# EAGLE design tutorial (EAGLE 8.7.0)
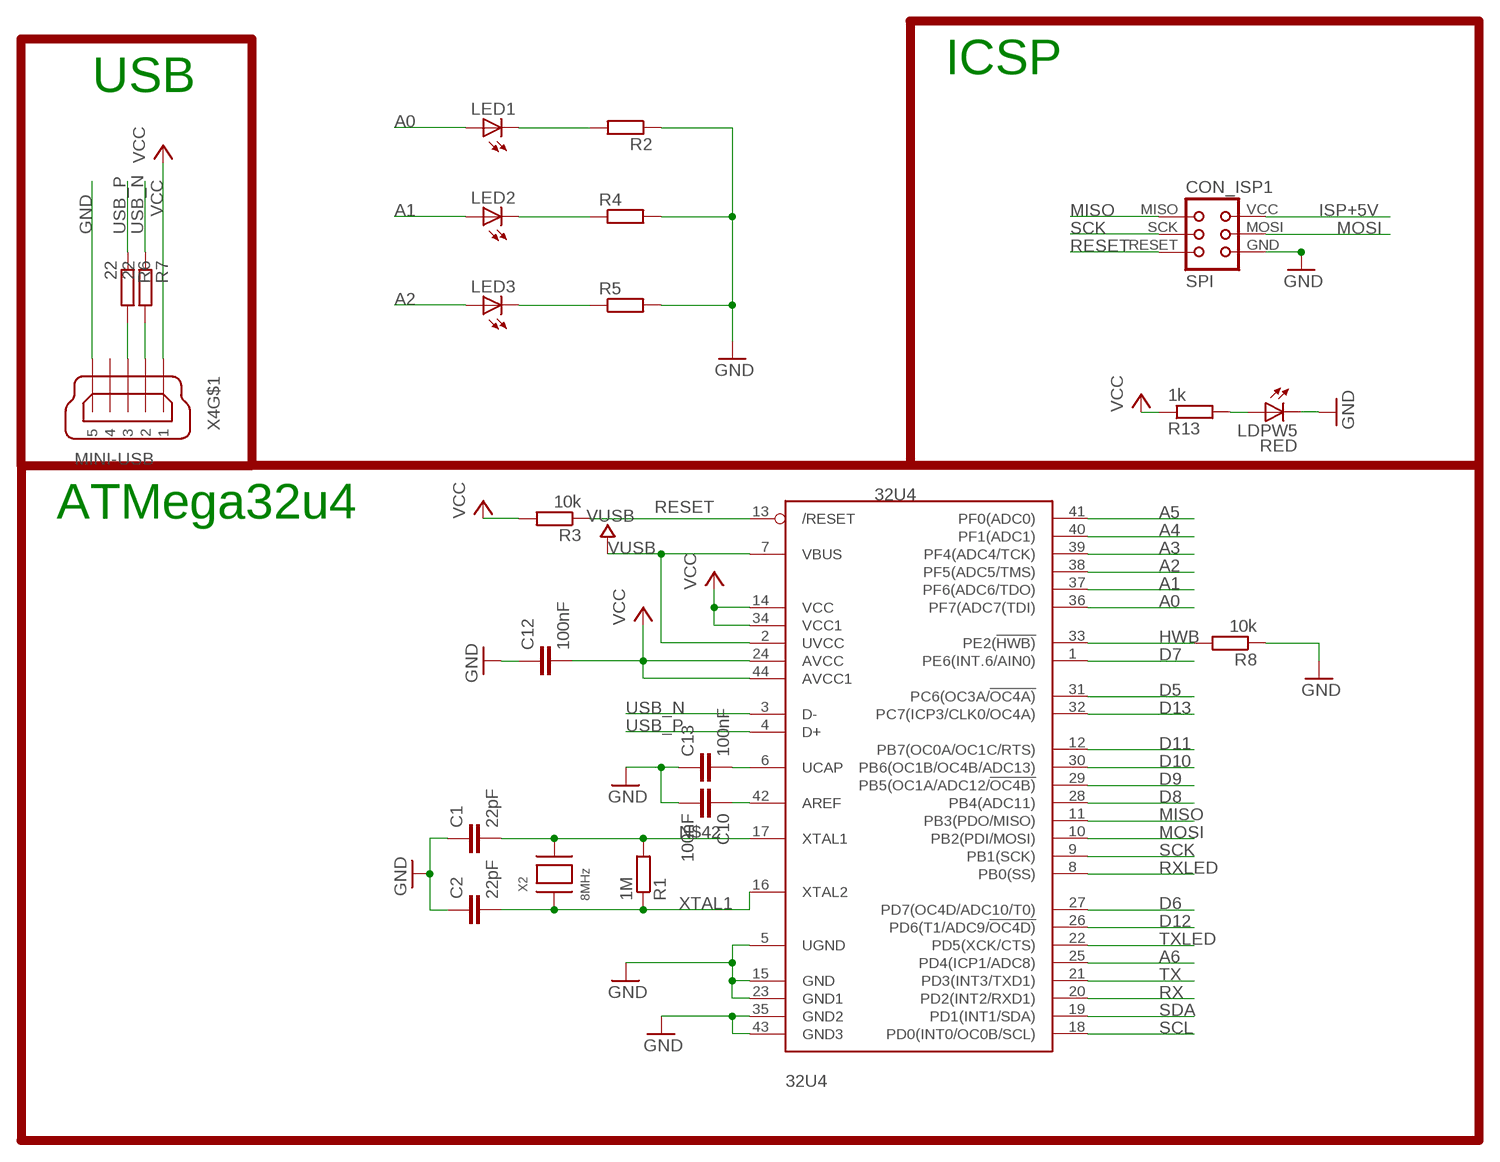
[diagram p0: schematic, sheet 1]

## Parts
32U4  32U4  ATMEGA32U4-AU  [TQFP44]
C1  22pF  C-EUC1206  [C1206]
C2  22pF  C-EUC1206  [C1206]
C10  100nF  C-EUC1206  [C1206]
C12  100nF  C-EUC1206  [C1206]
C13  100nF  C-EUC1206  [C1206]
CON_ISP1  SPI  TINYISP  [TINYISP]
LDPW5  RED  LED1206  [LED-1206]
LED1  LED5MM  [LED5MM]
LED2  LED5MM  [LED5MM]
LED3  LED5MM  [LED5MM]
R1  1M  R-EU_M1206  [M1206]
R2  R-EU_R1206  [R1206]
R3  10k  R-EU_M1206  [M1206]
R4  R-EU_R1206  [R1206]
R5  R-EU_R1206  [R1206]
R6  22  R-EU_M1206  [M1206]
R7  22  R-EU_M1206  [M1206]
R8  10k  R-EU_M1206  [M1206]
R13  1k  R-EU_M1206  [M1206]
X2  8MHz  XTALNX6035  [NX6035]
X4  MINI-USB  MINI-USB-SCHIELD-32005-201  [32005-201]

## Nets
A0: 32U4.36(PF7(ADC7(TDI)) LED1.A
A1: 32U4.37(PF6(ADC6/TDO)) LED2.A
A2: 32U4.38(PF5(ADC5/TMS)) LED3.A
A3: 32U4.39(PF4(ADC4/TCK))
A4: 32U4.40(PF1(ADC1))
A5: 32U4.41(PF0(ADC0))
A6: 32U4.25(PD4(ICP1/ADC8))
AREF: 32U4.42(AREF) C10.1
D5: 32U4.31(PC6(OC3A/!OC4A))
D6: 32U4.27(PD7(OC4D/ADC10/T0))
D7: 32U4.1(PE6(INT.6/AIN0))
D8: 32U4.28(PB4(ADC11))
D9: 32U4.29(PB5(OC1A/ADC12/!OC4B))
D10: 32U4.30(PB6(OC1B/OC4B/ADC13))
D11: 32U4.12(PB7(OC0A/OC1C/RTS))
D12: 32U4.26(PD6(T1/ADC9/!OC4D))
D13: 32U4.32(PC7(ICP3/CLK0/OC4A))
GND [power]: 32U4.5(UGND) 32U4.15(GND) 32U4.23(GND1) 32U4.35(GND2) 32U4.43(GND3) C1.1 C2.1 C10.2 C12.1 C13.1 CON_ISP1.GND LDPW5.C R2.1 R4.2 R5.2 R8.1 X4.5
HWB: 32U4.33(PE2(!HWB)) R8.2
ISP+5V: CON_ISP1.VCC
MISO: 32U4.11(PB3(PDO/MISO)) CON_ISP1.MISO
MOSI: 32U4.10(PB2(PDI/MOSI)) CON_ISP1.MOSI
N$1: 32U4.6(UCAP) C13.2
N$5: LED3.K(C) R5.1
N$6: LED2.K(C) R4.1
N$7: LED1.K(C) R2.2
N$12: LDPW5.A R13.2
N$42: 32U4.17(XTAL1) C1.2 R1.2 X2.P$2
RESET: 32U4.13(/RESET) CON_ISP1.RESET R3.1
RX: 32U4.20(PD2(INT2/RXD1))
RXLED: 32U4.8(PB0(SS))
SCK: 32U4.9(PB1(SCK)) CON_ISP1.SCK
SCL: 32U4.18(PD0(INT0/OC0B/SCL))
SDA: 32U4.19(PD1(INT1/SDA))
TX: 32U4.21(PD3(INT3/TXD1))
TXLED: 32U4.22(PD5(XCK/CTS))
USB_N: 32U4.3(D-) R7.1
USB_P: 32U4.4(D+) R6.1
USBC_N: R7.2 X4.2
USBC_P: R6.2 X4.3
VCC: 32U4.14(VCC) 32U4.24(AVCC) 32U4.34(VCC1) 32U4.44(AVCC1) C12.2 R3.2 R13.1 X4.1
VUSB: 32U4.2(UVCC) 32U4.7(VBUS)
XTAL1: 32U4.16(XTAL2) C2.2 R1.1 X2.P$1
Unconnected: X4.4 X4.M1(S:S1) X4.M2(S:S2) X4.M3(S:S3) X4.M4(S:S4)

## Notes on the sheet
- ICSP
- USB
- ATMega32u4

## Library data of the parts
32U4 = adafruit:ATMEGA32U4: http://www.ladyada.net/library/eagle
C1 C2 C10 C12 C13 = resistor:C-EU: CAPACITOR, European symbol
CON_ISP1 = lpatiny:TINYISP: CONNECTOR; OC_FARNELL: unknown; OC_NEWARK: unknown
LDPW5 = SparkFun:LED: LEDs Standard schematic elements and footprints for 5mm, 3mm, 1206, and 0603 sized LEDs. 5mm - Spark Fun Electronics SKU : COM-00529 (and others)
LED1-LED3 = led:LED: LED OSRAM: - CHIPLED LG R971, LG N971, LY N971, LG Q971, LY Q971, LO R971, LY R971 LH N974, LH R974 LS Q976, LO Q976, LY Q976 LO Q996 - Hyper CHIPLED LW Q18S LB Q993, LB Q99A, LB R99A - SideLED LS A670, LO A670, LY A670, LG A670, LP A670 LB A673, LV A673, LT A673, LW A673 LH A674 LY A675 LS A676, LA A676, LO A676, LY A676, LW A676 LS A679, LY A679, LG A679 - Hyper Micro SIDELED® LS Y876, LA Y876, LO Y876, LY Y876 LT Y87S - SmartLED LW L88C, LW L88S LB L89C, LB L89S, LG L890 LS L89K, LO L89K, LY L89K LS L896, LA L896, LO L896, LY L896 - TOPLED LS T670, LO T670, LY T670, LG T670, LP T670 LSG T670, LSP T670, LSY T670, LOP T670, LYG T670 LG T671, LOG T671, LSG T671 LB T673, LV T673, LT T673, LW T673 LH T674 LS T676, LA T676, LO T676, LY T676, LB T676, LH T676, LSB T676, LW T676 LB T67C, LV T67C, LT T67C, LS T67K, LO T67K, LY T67K, LW E67C LS E67B, LA E67B, LO E67B, LY E67B, LB E67C, LV E67C, LT E67C LW T67C LS T679, LY T679, LG T679 LS T770, LO T770, LY T770, LG T770, LP T770 LB T773, LV T773, LT T773, LW T773 LH T774 LS E675, LA E675, LY E675, LS T675 LS T776, LA T776, LO T776, LY T776, LB T776 LHGB T686 LT T68C, LB T68C - Hyper Mini TOPLED® LB M676 - Mini TOPLED Santana® LG M470 LS M47K, LO M47K, LY M47K Source: http://www.osram.convergy.de LUXEON: - LUMILED® LXK2-PW12-R00, LXK2-PW12-S00, LXK2-PW14-U00, LXK2-PW14-V00 LXK2-PM12-R00, LXK2-PM12-S00, LXK2-PM14-U00 LXK2-PE12-Q00, LXK2-PE12-R00, LXK2-PE12-S00, LXK2-PE14-T00, LXK2-PE14-U00 LXK2-PB12-K00, LXK2-PB12-L00, LXK2-PB12-M00, LXK2-PB14-N00, LXK2-PB14-P00, LXK2-PB14-Q00 LXK2-PR12-L00, LXK2-PR12-M00, LXK2-PR14-Q00, LXK2-PR14-R00 LXK2-PD12-Q00, LXK2-PD12-R00, LXK2-PD12-S00 LXK2-PH12-R00, LXK2-PH12-S00 LXK2-PL12-P00, LXK2-PL12-Q00, LXK2-PL12-R00 Source: www.luxeon.com KINGBRIGHT: KA-3528ASYC Source: www.kingbright.com
R1 R3-R5 = rcl:R-EU_: RESISTOR, European symbol; SPICEPREFIX: R
R2 = rcl:R-EU_: RESISTOR, European symbol; LCSC: 12345; SPICEPREFIX: R
R6-R8 R13 = rcl:R-EU_: RESISTOR, European symbol
X2 = lpatiny:XTAL: Low cost SMT crystals, no capacitors included http://www.ladyada.net/library/eagle
X4 = con-cypressindustries:MINI-USB-SCHIELD-: MINI USB-B Conector Source: www.cypressindustries.com; OC_FARNELL: unknown; OC_NEWARK: unknown

## Net classes
0 default: width 0.406 mm, clearance 0.25 mm
1 power: width 0.406 mm, drill 0.305 mm, clearance 0.25 mm
2 VIN: width 0.406 mm, clearance 0.25 mm
3 fine: width 0.406 mm, clearance 0.25 mm
4 aref: width 0.406 mm, clearance 0.25 mm

## Board
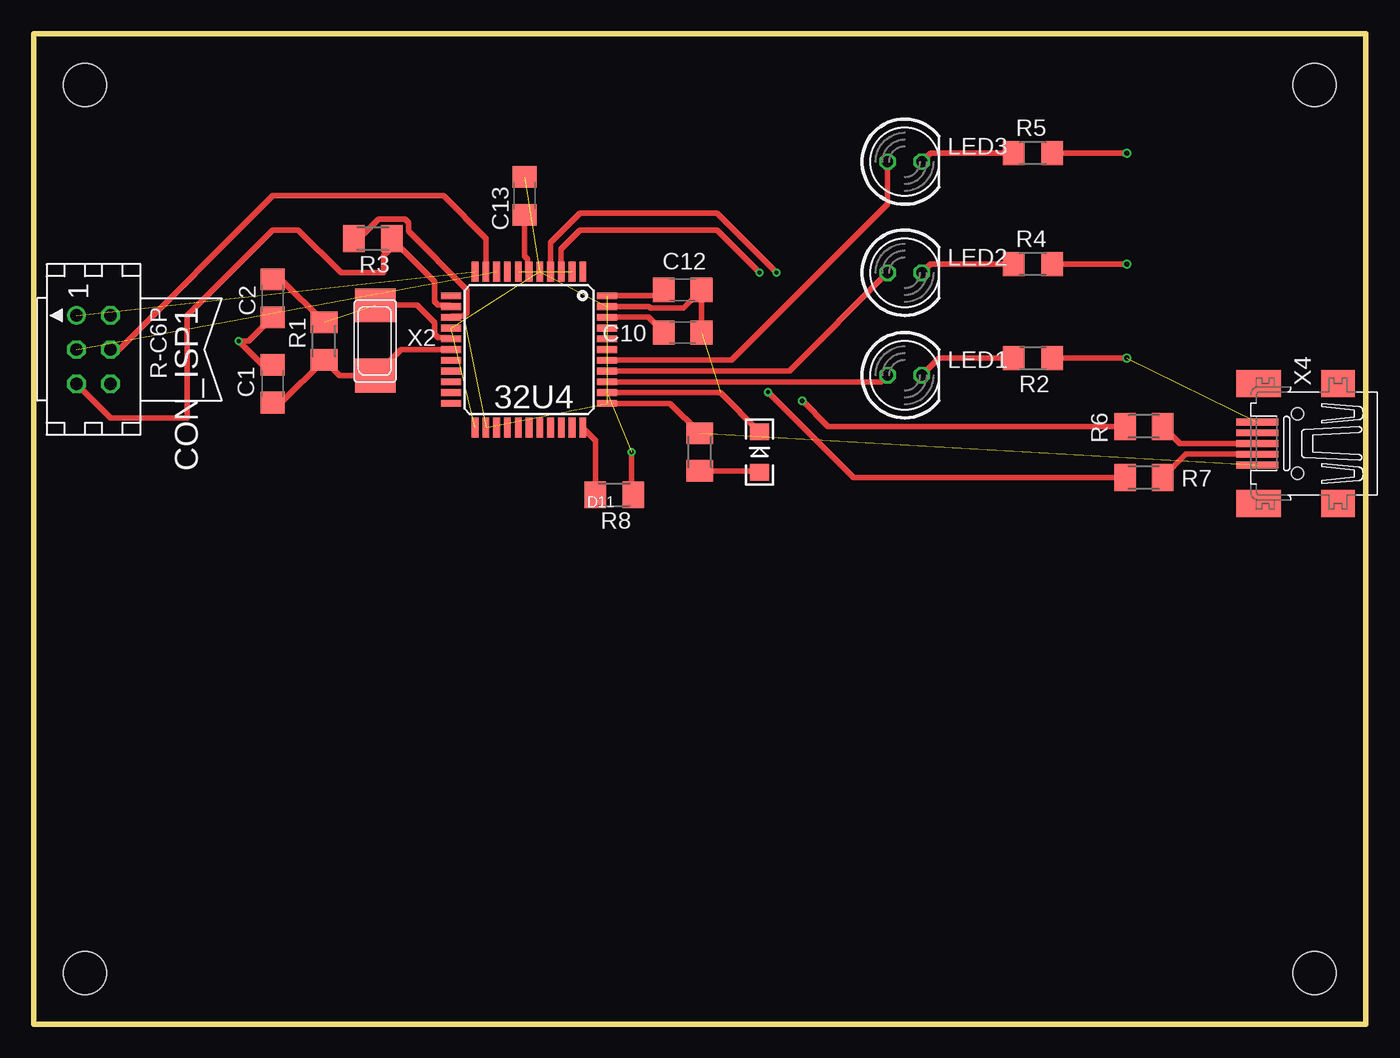
[diagram p1: board, top side]
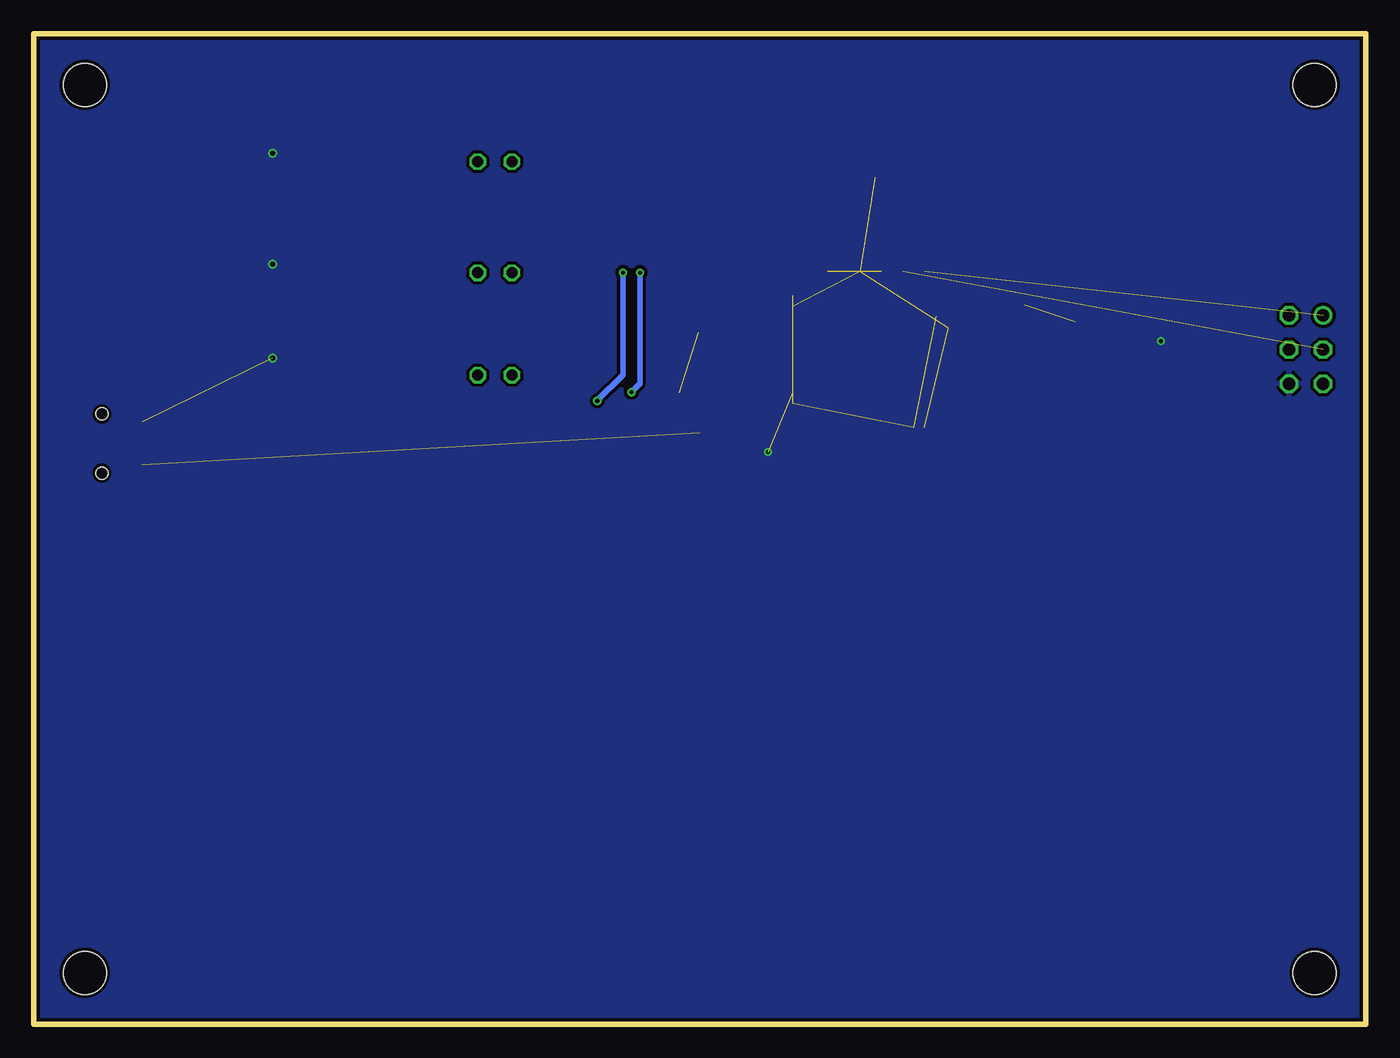
[diagram p2: board, bottom side, seen from below]

Size 99.06 x 73.66 mm. Coordinates in mm from the lower left corner, seen from the top.
Outline: 0,73.66 0,0 99.06,0 99.06,73.66 0,73.66
Copper layers (1*16): Top 0.035mm / dielectric 0.2mm / Bottom 0.035mm
Design rules "SeeedStudio_DRU_no_angle_20130527 *": minimum track width 6mil, minimum drill 12mil, track to track 6mil, track to pad 6mil, pad to pad 6mil, via to via 6mil, smd to smd 0mil, copper to edge 10mil, drill to drill 10mil, minimum pad ring 6mil, minimum via ring 6mil, stop-mask expansion 2mil, vias tented up to drill 25mil, thermal gap 10mil
Holes 3.2 mm at 3.81,69.85 3.81,3.81 95.25,69.85 95.25,3.81

### Footprints (pad centres in the part's own frame; a part is rotated, then mirrored left to right if it is on the bottom)
TQFP44 = smd 1.5 x 0.5: 1 -5.8,4; 2 -5.8,3.2; 3 -5.8,2.4; 4 -5.8,1.6; 5 -5.8,0.8; 6 -5.8,0; 7 -5.8,-0.8; 8 -5.8,-1.6; 9 -5.8,-2.4; 10 -5.8,-3.2; 11 -5.8,-4; 23 5.8,-4; 24 5.8,-3.2; 25 5.8,-2.4; 26 5.8,-1.6; 27 5.8,-0.8; 28 5.8,0; 29 5.8,0.8; 30 5.8,1.6; 31 5.8,2.4; 32 5.8,3.2; 33 5.8,4 | smd 0.5 x 1.5: 12 -4,-5.8; 13 -3.2,-5.8; 14 -2.4,-5.8; 15 -1.6,-5.8; 16 -0.8,-5.8; 17 0,-5.8; 18 0.8,-5.8; 19 1.6,-5.8; 20 2.4,-5.8; 21 3.2,-5.8; 22 4,-5.8; 34 4,5.8; 35 3.2,5.8; 36 2.4,5.8; 37 1.6,5.8; 38 0.8,5.8; 39 0,5.8; 40 -0.8,5.8; 41 -1.6,5.8; 42 -2.4,5.8; 43 -3.2,5.8; 44 -4,5.8
C1206 = smd 1.6 x 1.8: 1 -1.4,0; 2 1.4,0
TINYISP = drill 0.914 octagon: GND 2.54,1.27; MOSI 0,1.27; RESET 2.54,-1.27; SCK 0,-1.27; VCC -2.54,1.27 | drill 0.914: MISO -2.54,-1.27
LED-1206 = smd 1.2 x 1.4: A -1.5,0; C 1.5,0
LED5MM = drill 0.813 octagon: A -1.27,0; K 1.27,0
M1206 = smd 1.6 x 2: 1 -1.4,0; 2 1.4,0
R1206 = smd 1.6 x 1.803: 1 -1.422,0; 2 1.422,0
NX6035 = smd 2.5 x 3: P$1 2.665,0; P$2 -2.565,0
32005-201 = smd 3.1 x 0.5: 1 3,1.6; 2 3,0.8; 3 3,0; 4 3,-0.8; 5 3,-1.6 | smd 2.5 x 2: M1 -3,-4.45; M2 -3,4.45 | smd 3.3 x 2: M3 2.9,4.45; M4 2.9,-4.45 | hole 0.9: 0,2.2; 0,-2.2

### Placement (x,y rotation side)
32U4  36.83,50.16 270 top
C1  17.78,47.62 270 top
C2  17.78,53.98 90 top
C10  48.26,51.44 0 top
C12  48.26,54.61 180 top
C13  36.51,61.59 270 top
CON_ISP1  4.45,50.16 270 top
LDPW5  53.98,42.55 90 top
LED1  64.77,48.26 0 top
LED2  64.77,55.88 0 top
LED3  64.77,64.14 0 top
R1  21.59,50.8 270 top
R2  74.3,49.53 180 top
R3  25.23,58.42 180 top
R4  74.3,56.52 0 top
R5  74.3,64.77 0 top
R6  82.55,44.45 0 top
R7  82.55,40.64 0 top
R8  43.18,39.37 180 top
R13  49.53,42.55 270 top
X2  25.4,50.8 90 top
X4  93.98,43.18 180 top

### Tracks (layer width: path | path; a pad name or v marks a point on that pad's centre or on a via)
A0
  Top 0.406: 32U4.36 63.01,47.77 LED1.A
A1
  Top 0.406: 32U4.37 56.19,48.56 LED2.A
A2
  Top 0.406: 32U4.38 51.91,49.37 63.5,60.96 LED3.A
AREF
  Top 0.406: C10.1 45.73,52.56 32U4.42
GND  (via drill 0.3, 0.35)  (7 unrouted)
  Top 0.406: R4.2 v81.28,56.52 | R5.2 v81.28,64.77 | R2.1 v81.28,49.53 | LDPW5.C 51.05,46.97 32U4.35 | R8.1 44.45,39.5 v44.45,42.55 | C1.1 17.02,49.02 v15.24,50.8 16,50.8 C2.1 | C10.2 C12.1 48.31,53.26 45.87,53.26 45.76,53.37 32U4.43
  pour Bottom: 0,73.66 0,0 99.06,0 99.06,73.66
HWB
  Top 0.406: R8.2 41.78,43.41 32U4.33
MISO  (1 unrouted)
MOSI
  Top 0.406: CON_ISP1.MOSI 6.35,50.16 17.78,61.59 30.48,61.59 33.66,58.42 33.63,58.4 32U4.10
N$1
  Top 0.406: C13.2 36.51,57.12 36.73,56.9 36.73,56.06 32U4.6
N$5
  Top 0.406: R5.1 66.67,64.77 LED3.K
N$6
  Top 0.406: R4.1 66.67,56.52 LED2.K
N$7
  Top 0.406: R2.2 67.31,49.53 LED1.K
N$12
  Top 0.406: R13.2 53.88,41.15 LDPW5.A
N$42
  Top 0.406: 32U4.17 27.33,50.16 X2.P$2 22.75,48.23 R1.2 18.41,46.23 C1.2
RESET
  Top 0.406: R3.1 26.97,58.08 | 26.97,58.08 29.83,55.22 29.83,53.73 30.09,53.46 30.93,53.46 32U4.13 | CON_ISP1.RESET 5.71,45.09 11.43,45.09 11.43,52.7 17.78,59.05 19.68,59.05 22.86,55.88 26.04,55.88 26.04,57.15 26.97,58.08
SCK  (1 unrouted)
USB_N  (via drill 0.3)
  Top 0.406: R7.1 60.96,40.64 v54.61,46.99 | v53.98,55.88 50.8,59.05 40.64,59.05 39.23,57.65 32U4.3
  Bottom 0.406: v54.61,46.99 53.98,47.62 v53.98,55.88
USB_P  (via drill 0.3)
  Top 0.406: R6.1 59.05,44.45 v57.15,46.35 | v55.24,55.88 50.8,60.33 40.64,60.33 38.43,58.12 32U4.4
  Bottom 0.406: v57.15,46.35 55.24,48.26 v55.24,55.88
USBC_N
  Top 0.406: X4.2 85.69,42.38 R7.2
USBC_P
  Top 0.406: X4.3 85.22,43.18 R6.2
VCC  (4 unrouted)
  Top 0.406: R13.1 47.31,46.16 32U4.34 | 32U4.14 31.13,52.66 31.97,52.66 32.23,52.93 32.23,54.6 27.88,58.95 27.88,59.61 27.62,59.87 25.64,59.87 24.19,58.42 R3.2 | C12.2 46.41,54.16 32U4.44
VUSB  (1 unrouted)
XTAL1  (1 unrouted)
  Top 0.406: X2.P$1 28.53,53.47 29.83,52.17 29.83,51.33 30.09,51.06 30.93,51.06 32U4.16 | R1.1 18.41,55.38 C2.2

### Text on the board
tNames: D11
tValues: Tutorial V 1.0.0
bValues: Tutorial V 1.0.0